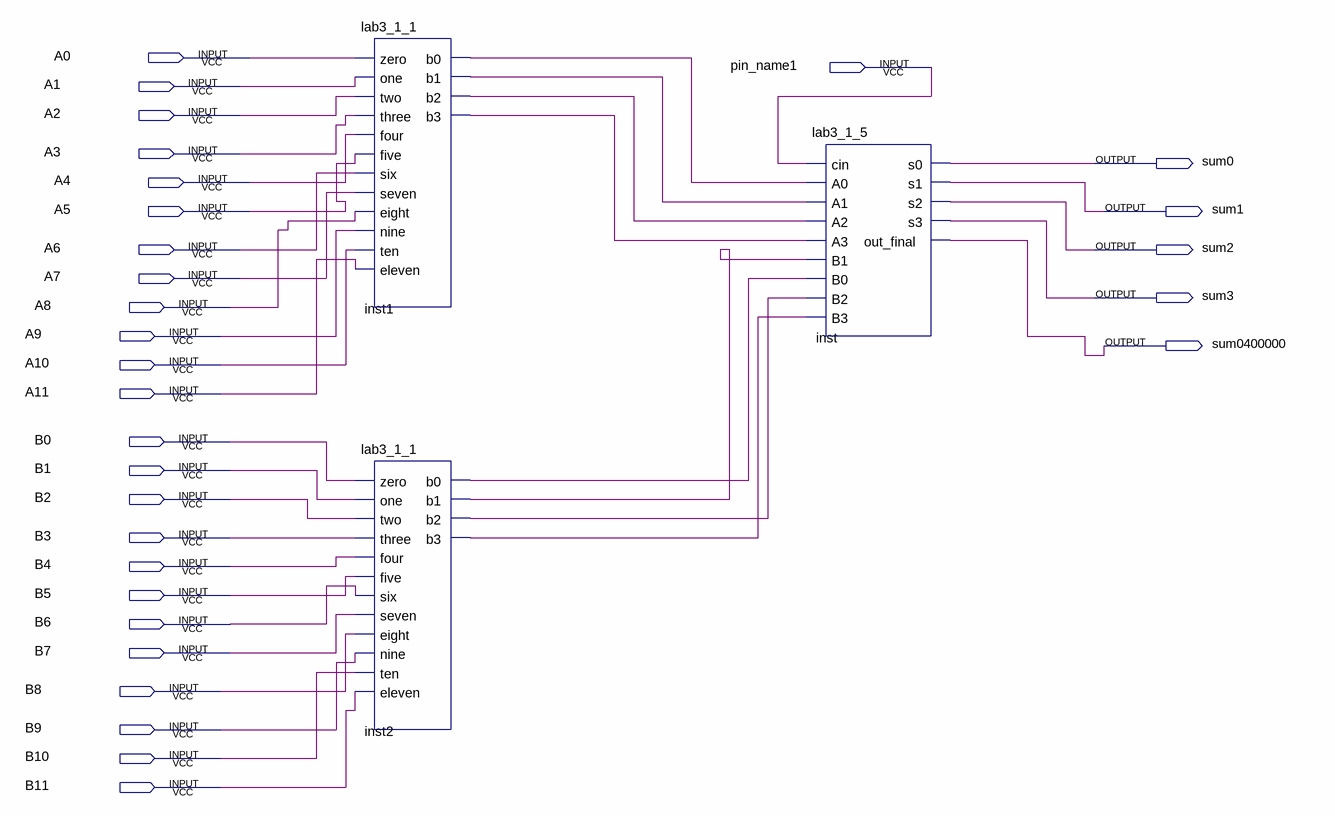
[diagram p0: schematic sheet]
// Quartus schematic hw2.bdf as structural Verilog: 3 symbols, 30 pins
module hw2 (
  input  A0,
  input  pin_name1,
  input  A1,
  input  A2,
  input  A3,
  input  A4,
  input  A5,
  input  A6,
  input  A7,
  input  A8,
  input  A9,
  input  A10,
  input  A11,
  input  B0,
  input  B1,
  input  B2,
  input  B3,
  input  B4,
  input  B5,
  input  B6,
  input  B7,
  input  B8,
  input  B9,
  input  B10,
  input  B11,
  output sum0,
  output sum1,
  output sum2,
  output sum3,
  output sum0400000
);

  wire inst1_b0, inst1_b1, inst1_b2, inst1_b3, inst2_b0, inst2_b1, inst2_b2, inst2_b3;

  lab3_1_1 inst1 (
    .zero(A0), .one(A1), .two(A2), .three(A3), .four(A4), .five(A5), .six(A6), .seven(A7), .eight(A8),
    .nine(A9), .ten(A10), .eleven(A11), .b0(inst1_b0), .b1(inst1_b1), .b2(inst1_b2), .b3(inst1_b3));
  lab3_1_1 inst2 (
    .zero(B0), .one(B1), .two(B2), .three(B3), .four(B4), .five(B5), .six(B6), .seven(B7), .eight(B8),
    .nine(B9), .ten(B10), .eleven(B11), .b0(inst2_b0), .b1(inst2_b1), .b2(inst2_b2), .b3(inst2_b3));
  lab3_1_5 inst (
    .cin(pin_name1), .A0(inst1_b0), .A1(inst1_b1), .A2(inst1_b2), .A3(inst1_b3), .B1(inst2_b1),
    .B0(inst2_b0), .B2(inst2_b2), .B3(inst2_b3), .s0(sum0), .s1(sum1), .s2(sum2), .s3(sum3),
    .out_final(sum0400000));
endmodule
